# Altium schematic sheet Pwr.SchDoc
size A4; SheetNumber: 3; SheetTotal: 4
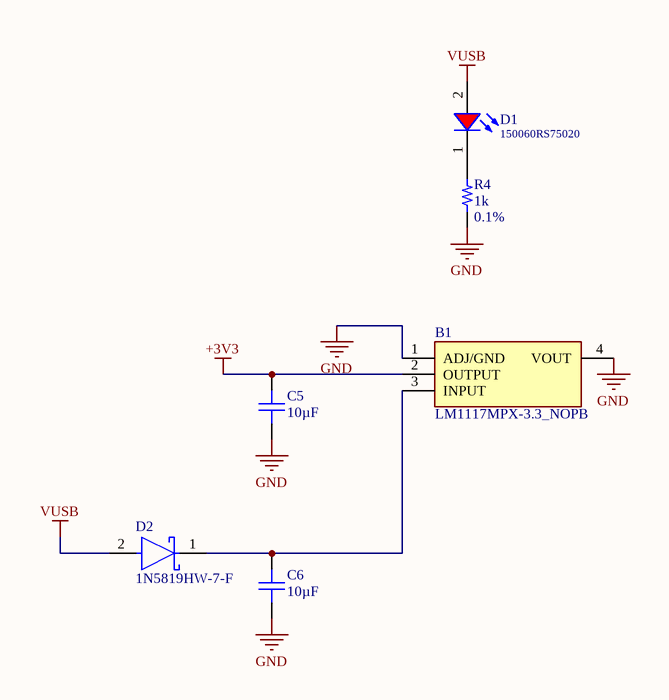
[diagram p0: Pwr.SchDoc]

## Parts
B1  LM1117MPX-3.3_NOPB  [SOT230P700X180-4N]
C5  value 10µF  [FP-GRM188-0_2-IPC_B]  (hidden comment: GRM188R61E106MA73J)
C6  value 10µF  [FP-GRM188-0_2-IPC_B]  (hidden comment: GRM188R61E106MA73J)
D1  150060RS75020  [WL-SMCW_0603_H=0.25mm]
D2  1N5819HW-7-F  [FP-SOD123-IPC_A]
R4  value 1k  Tolerance: 0.1%  [RESC1608X06L 0603 High Density]  (hidden comment: RG1608P-102-B-T5)

## Nets
+3V3: B1.2(OUTPUT) C5.2
GND: B1.1(ADJ/GND) B1.4(VOUT) C5.1 C6.1 R4.1
VUSB: D1.2(A) D2.2(A)
NetB1_3: B1.3(INPUT) C6.2 D2.1(C)
NetD1_1: D1.1(K) R4.2

## Library data of the parts
B1 = LM1117MPX-3.3_NOPB: Space saving 800-mA low-dropout linear regulator with internal current limit; Manufacturer_Name: Texas Instruments; Manufacturer_Part_Number: LM1117MPX-3.3/NOPB; Geometry.Height: 1.8mm; Mouser Part Number: 926-LM1117MPX3.3NOPB; Mouser Price/Stock: https://www.mouser.co.uk/ProductDetail/Texas-Instruments/LM1117MPX-3.3-NOPB?qs=X1J7HmVL2ZHRbBIxXi4utg%3D%3D; Datasheet Link: http://www.ti.com/lit/ds/symlink/lm1117.pdf
C5 C6 = CMP-001-00049-1: Ceramic Capacitor, Multilayer, Ceramic, 25V, 20% +Tol, 20% -Tol, X5R, 15% TC, 10uF, Surface Mount, 0603; Multilayer: Yes; Height: 0.8mm; JESD-609 Code: e3; Rated DC Voltage (URdc): 25V; RoHS Compliant: Yes; Pins: 2; Tolerance (fill in as +-): 20%; Temperature Characteristics Code: X5R; Length: 1.6mm; Case/Package: 0603; Mounting Technology: Surface Mount; Termination: Wraparound; Package Shape: Rectangular; Reach SVHC Compliant: Yes; Dielectric Material: Ceramic; Terminal Finish: Nickel; Max Operating Temperature: 85°C; Capacitor Type: Ceramic; Packaging: Tape and Reel; Min Operating Temperature: -55°C; Package Style: SMTMeter; Tolerance  (fill in as +-): 20%; Width: 0.8mm
D1 = CMP-029-000007-2: WL-SMCW SMT Mono-color Chip LED Waterclear, size 0603, Red, 2V, 140deg; Chip Technology: AlInGaP; Luminous Intensity typ.: 100mcd; Peak Wavelength typ.: 630nm; Dominant Wavelength typ.: 625nm; Publisher: Wurth Elektronik; ComponentLink1Description: Manufacturer; Emitting Color: Red; ComponentLink2URL: https://www.we-online.com/catalog/datasheet/150060RS75020.pdf; Published Date: March 2020; ComponentLink1URL: http://www.we-online.de; Mounting Technology: SMT; Forward Voltage typ.: 2V; Operating Temperature: -40 to +85degC; Size: 0603; Source: WL-SMCW_0603.SchLib; Packaging: Tape and Reel; Viewing Angle: 140deg; Part Number: 150060RS75020; Design Item ID: 150060RS75020; ComponentLink2Description: Datasheet
D2 = CMP-0303-00003-3: DIODE SCHOTTKY 40V 1A SOD123; Forward Voltage: 450mV; Capacitance: 110pF; Max Forward Surge Current (Ifsm): 25A; Peak Reverse Current: 50uA; Polarity: Standard; Element Configuration: Single; Max Power Dissipation: 450mW; Min Operating Temperature: -65°C; Package Quantity: 3000; Contact Plating: Tin; Weight: 0.000353oz; Max Repetitive Reverse Voltage (Vrrm): 40V; Max Reverse Voltage (DC): 40V; Height: 1.25mm; Average Rectified Current: 1A; Width: 1.7mm; Case/Package: SOD-123-2; Lead Free: Lead Free; Max Operating Temperature: 125°C; Current Rating: 1A; Termination: SMD/SMT; Forward Current: 1A; Radiation Hardening: No; Number of Pins: 2; Length: 2.85mm; Voltage Rating (DC): 40V; REACH SVHC: No SVHC; Peak Non-Repetitive Surge Current: 25A; Packaging: Tape and Reel; Output Current: 1A
R4 = CMP-009-00031-4: SUSUMU - RG1608P-102-B-T5 - RES, THIN FILM, 1K, 0.1%, 0.1W, 0603; Max Power Dissipation: 100mW; Resistance: 1kR; Voltage Rating (DC): 75V; Voltage Rating: 100V; Temperature Coefficient: 25ppm/°C; Length: 1.6mm; Features: Automotive AEC-Q200,Anti-Sulfur; Depth: 0.8mm; Construction: Rectangular; Number of Terminations: 2; Width: 0.8mm; Lead Free: Lead Free; Weight: 7.1E-05oz; Height: 0.4mm; RoHS Compliant: Yes; Termination: SMD/SMT; Power Rating: 100mW; Min Operating Temperature: -55°C; Case/Package: 0603; Case Code (Imperial): 0603; Military Standard: Not; Resistor Type: Thin Film; Max Operating Temperature: 155°C; Working Voltage: 100V; Series: RG; Technology: THIN FILM; Packaging: Tape and Reel; Case Code (Metric): 1608